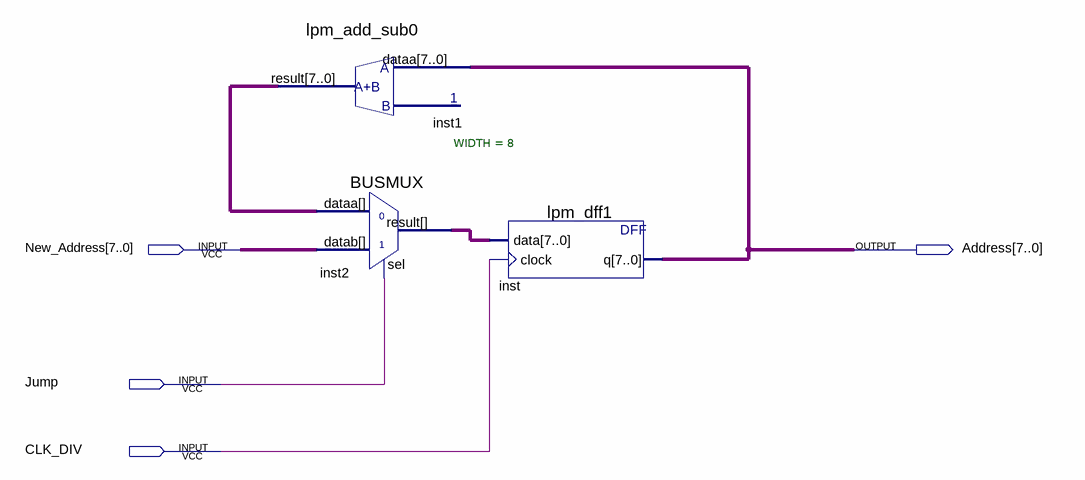
[diagram p0: schematic sheet]
// Quartus schematic IPRegister.bdf as structural Verilog: 3 symbols, 4 pins
module IPRegister (
  input  [7:0] New_Address,
  input  Jump,
  input  CLK_DIV,
  output [7:0] Address
);

  wire [7:0] inst1_result, inst2_result;

  lpm_add_sub0 inst1 (.dataa(Address), .result(inst1_result));
  BUSMUX #(.WIDTH(8)) inst2 (.datab(New_Address), .sel(Jump), .dataa(inst1_result), .result(inst2_result));
  lpm_dff1 inst (.data(inst2_result), .clock(CLK_DIV), .q(Address));
endmodule
